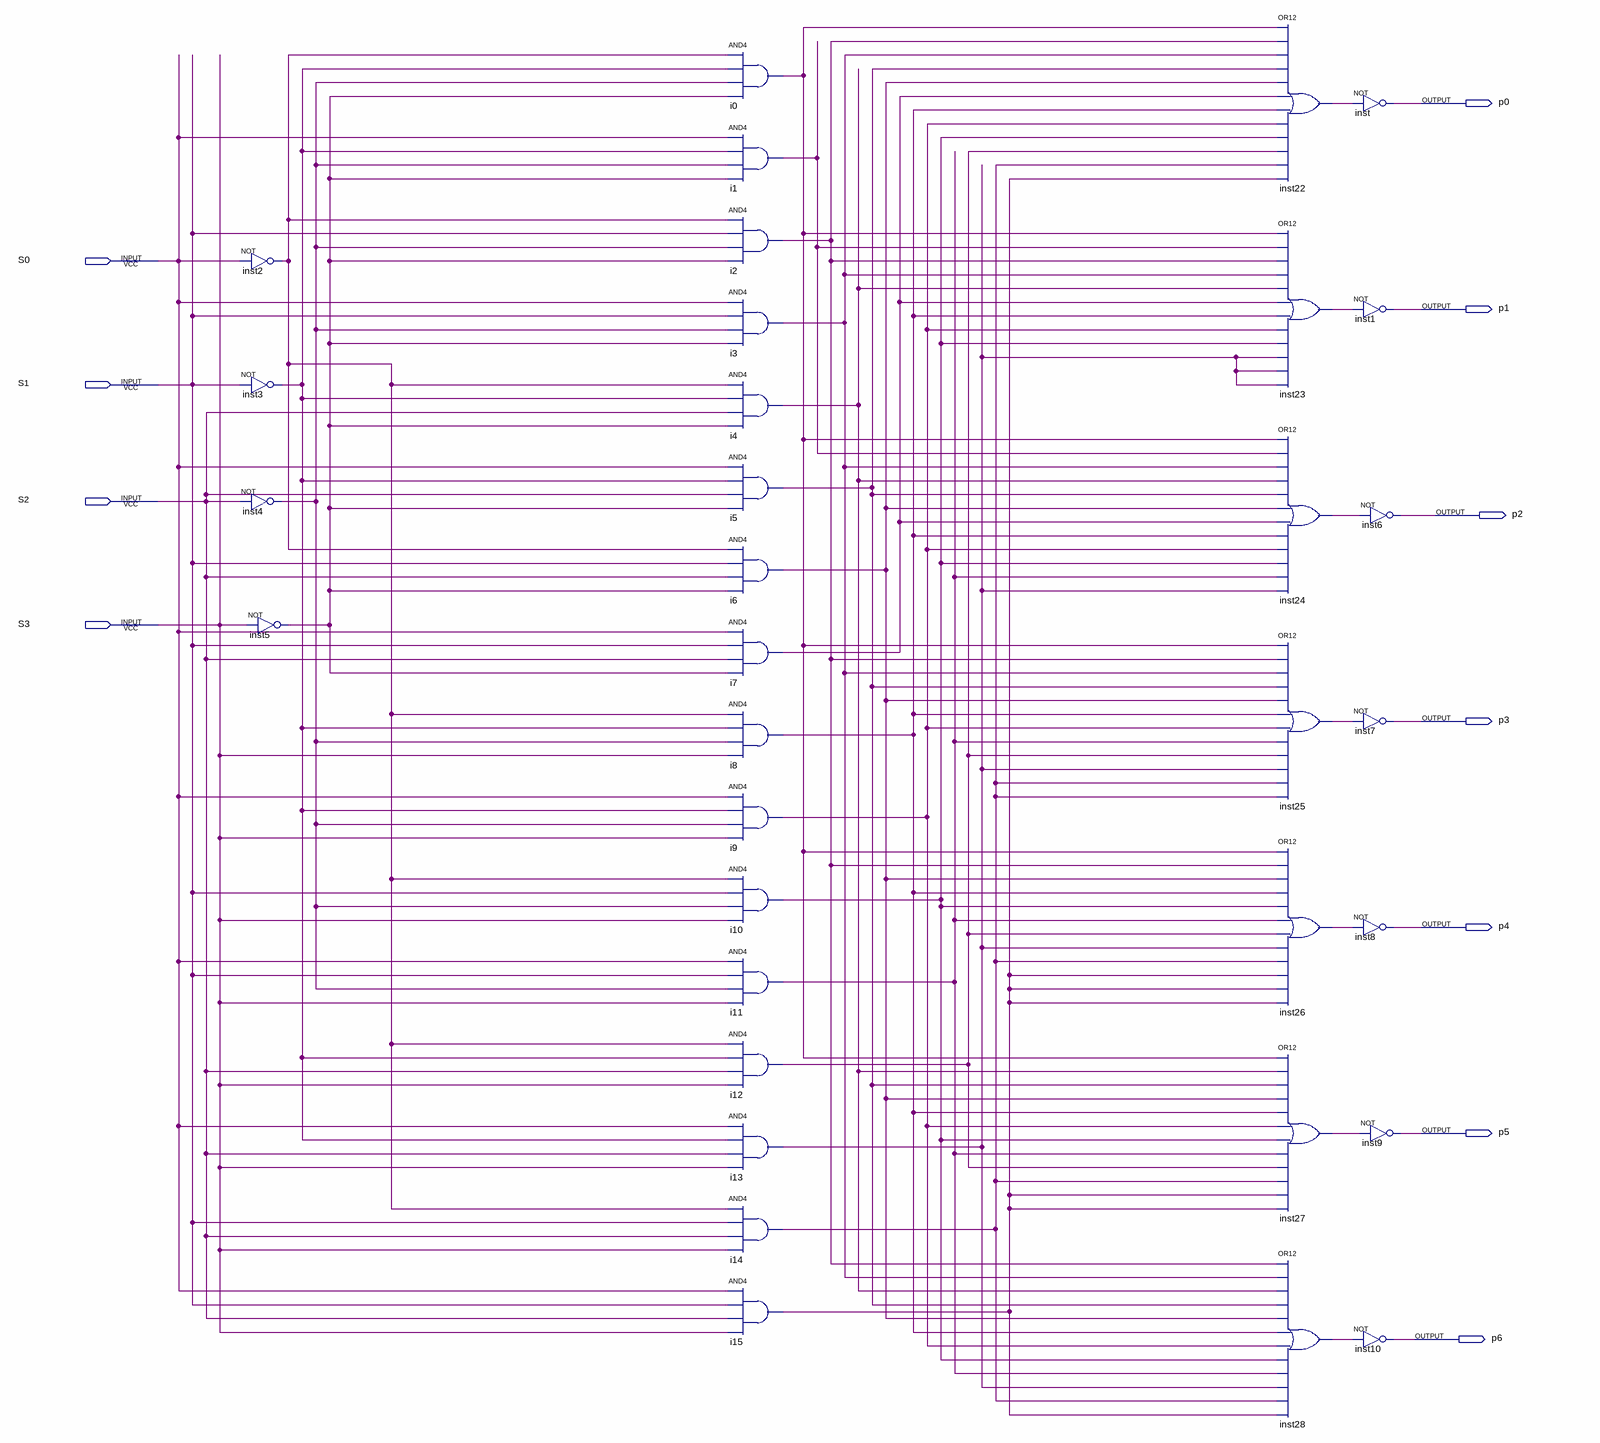
[diagram p0: schematic sheet]
// Quartus schematic p004_2.bdf as structural Verilog: 34 symbols, 11 pins
module p004_2 (
  input  S0,
  input  S1,
  input  S2,
  input  S3,
  output p0,
  output p1,
  output p2,
  output p3,
  output p4,
  output p5,
  output p6
);

  wire i0_out, i1_out, i2_out, i3_out, i4_out, i5_out, i6_out, i7_out, i8_out, i9_out, i10_out, i11_out,
       i12_out, i13_out, i14_out, i15_out, inst2_out, inst3_out, inst4_out, inst5_out, inst22_out,
       inst23_out, inst24_out, inst25_out, inst26_out, inst27_out, inst28_out;

  not inst2 (inst2_out, S0);
  not inst3 (inst3_out, S1);
  not inst4 (inst4_out, S2);
  not inst5 (inst5_out, S3);
  and i0 (i0_out, inst2_out, inst3_out, inst4_out, inst5_out);
  and i1 (i1_out, S0, inst3_out, inst4_out, inst5_out);
  and i2 (i2_out, inst2_out, S1, inst4_out, inst5_out);
  and i3 (i3_out, S0, S1, inst4_out, inst5_out);
  and i4 (i4_out, inst2_out, inst3_out, S2, inst5_out);
  and i5 (i5_out, S0, inst3_out, S2, inst5_out);
  and i6 (i6_out, inst2_out, S1, S2, inst5_out);
  and i7 (i7_out, S0, S1, S2, inst5_out);
  and i8 (i8_out, inst2_out, inst3_out, inst4_out, S3);
  and i9 (i9_out, S0, inst3_out, inst4_out, S3);
  and i10 (i10_out, inst2_out, S1, inst4_out, S3);
  and i11 (i11_out, S0, S1, inst4_out, S3);
  and i12 (i12_out, inst2_out, inst3_out, S2, S3);
  and i13 (i13_out, S0, inst3_out, S2, S3);
  and i14 (i14_out, inst2_out, S1, S2, S3);
  and i15 (i15_out, S0, S1, S2, S3);
  or inst22 (inst22_out, i0_out, i2_out, i3_out, i5_out, i6_out, i7_out, i8_out, i9_out, i10_out, i12_out, i14_out, i15_out);
  or inst23 (inst23_out, i0_out, i1_out, i2_out, i3_out, i4_out, i7_out, i8_out, i9_out, i10_out, i13_out, i13_out, i13_out);
  or inst24 (inst24_out, i0_out, i1_out, i3_out, i4_out, i5_out, i6_out, i7_out, i8_out, i9_out, i10_out, i11_out, i13_out);
  or inst25 (inst25_out, i0_out, i2_out, i3_out, i5_out, i6_out, i8_out, i9_out, i11_out, i12_out, i13_out, i14_out, i14_out);
  or inst26 (inst26_out, i0_out, i2_out, i6_out, i8_out, i10_out, i11_out, i12_out, i13_out, i14_out, i15_out, i15_out, i15_out);
  or inst27 (inst27_out, i0_out, i4_out, i5_out, i6_out, i8_out, i9_out, i10_out, i11_out, i12_out, i14_out, i15_out, i15_out);
  or inst28 (inst28_out, i2_out, i3_out, i4_out, i5_out, i6_out, i8_out, i9_out, i10_out, i11_out, i13_out, i14_out, i15_out);
  not inst (p0, inst22_out);
  not inst1 (p1, inst23_out);
  not inst7 (p3, inst25_out);
  not inst8 (p4, inst26_out);
  not inst10 (p6, inst28_out);
  not inst6 (p2, inst24_out);
  not inst9 (p5, inst27_out);
endmodule
